# Altium project WaterDepthAnalysisBoardv2.PrjPcb
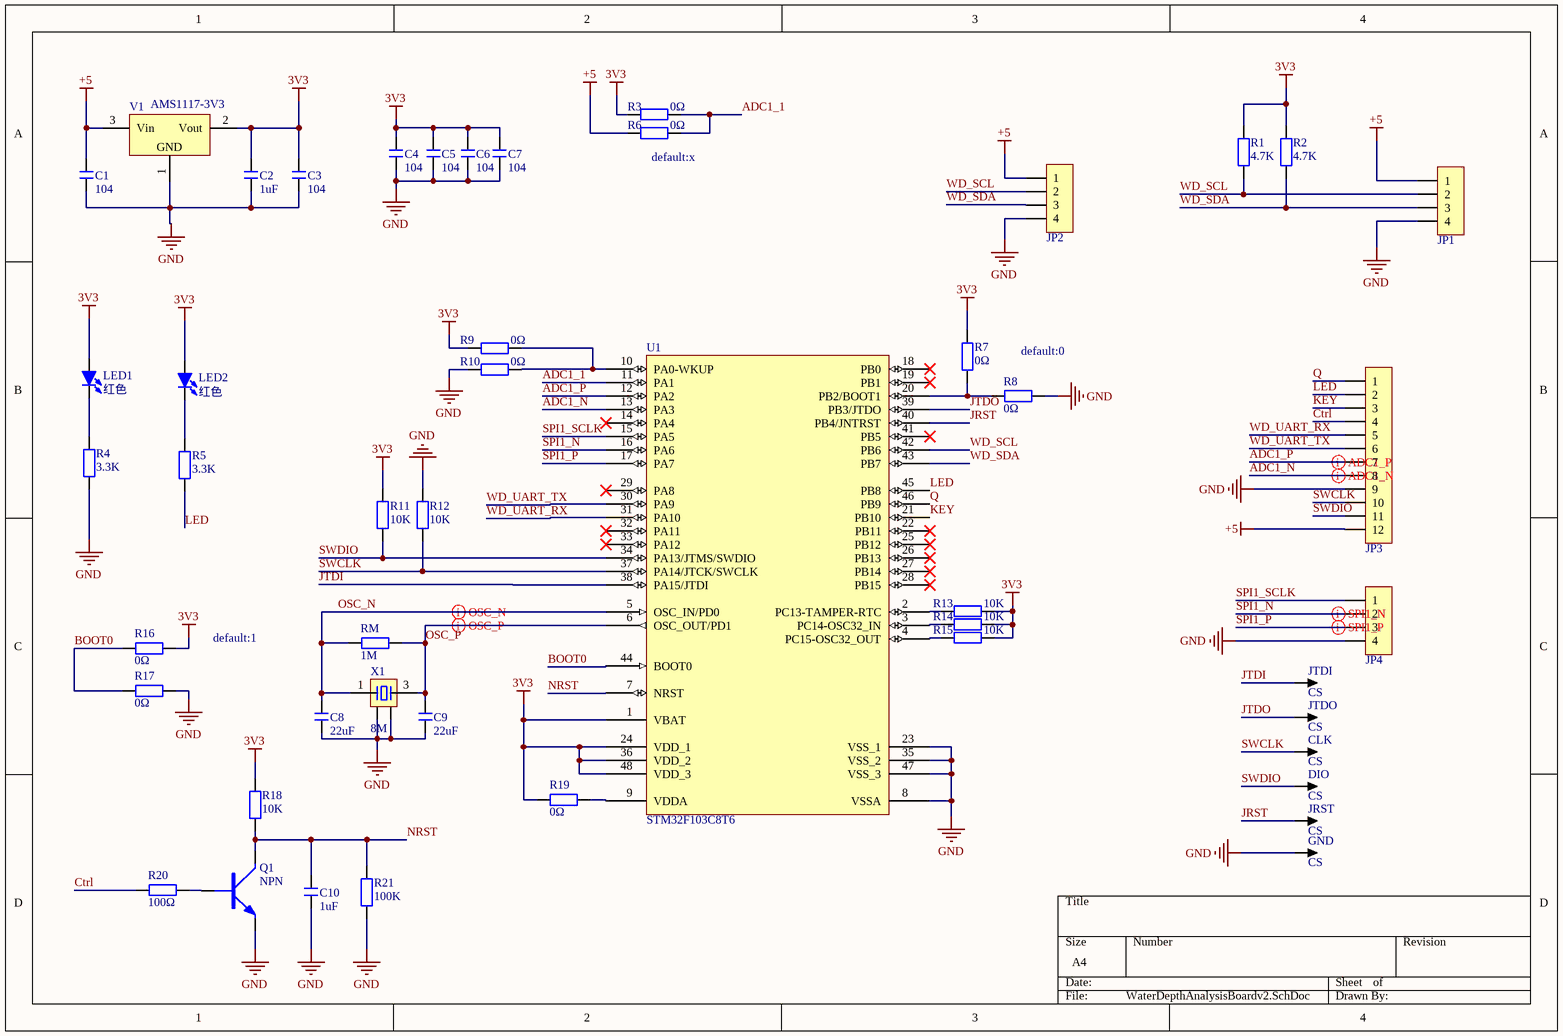
[diagram p0: WaterDepthAnalysisBoardv2.SchDoc]
1 sheet, 48 parts. Net scope: global (net labels, ports and power ports of the same name join across sheets).
Board file: WaterDepthAnalysisBoardv2.PcbDoc

## Sheet WaterDepthAnalysisBoardv2.SchDoc
size A4; SheetNumber: 1; SheetTotal: 1

### Parts
C1  104  [C 0603_L]
C2  1uF  [C 0603_L]
C3  104  [C 0603_L]
C4  104  [C 0603_L]
C5  104  [C 0603_L]
C6  104  [C 0603_L]
C7  104  [C 0603_L]
C8  22uF  [C 0603_L]
C9  22uF  [C 0603_L]
C10  1uF  [C 0603_L]
CLK  CS  [R100]
DIO  CS  [R100]
GND  CS  [R100]
JP1  HDR-1X4  [MX 1.25-LI-4P]  (value not drawn)
JP2  HDR-1X4  [MX 1.25-LS-4P]  (value not drawn)
JP3  HDR-1X12  [HDR2.54-LI-12P]  (value not drawn)
JP4  HDR-1X4  [HDR2.54-LI-4P]  (value not drawn)
JRST  CS  [R100]
JTDI  CS  [R100]
JTDO  CS  [R100]
LED1  红色  [LED 0603W]
LED2  红色  [LED 0603W]
Q1  NPN  [SOT-23]
R1  4.7K  [R 0603_L]
R2  4.7K  [R 0603_L]
R3  0Ω  [R 0603_L]
R4  3.3K  [R 0603_L]
R5  3.3K  [R 0603_L]
R6  0Ω  [R 0603_L]
R7  0Ω  [R 0603_L]
R8  0Ω  [R 0603_L]
R9  0Ω  [R 0603_L]
R10  0Ω  [R 0603_L]
R11  10K  [R 0603_L]
R12  10K  [R 0603_L]
R13  10K  [R 0603_L]
R14  10K  [R 0603_L]
R15  10K  [R 0603_L]
R16  0Ω  [R 0603_L]
R17  0Ω  [R 0603_L]
R18  10K  [R 0603_L]
R19  0Ω  [R 0603_L]
R20  100Ω  [R 0603_L]
R21  100K  [R 0603_L]
RM  1M  [R 0603_L]
U1  STM32F103C8T6  [LQFP48 7X7]
V1  AMS1117-3V3  [SOT89_N]
X1  8M  [OSC 5032-4P]

### Nets
3V3: C2.2 C3.2 C4.2 C5.2 C6.2 C7.2 LED1.1(A) LED2.1(A) R1.2 R2.2 R3.2 R7.1 R9.2 R11.1 R13.1 R14.1 R15.1 R16.1 R18.1 R19.2 U1.1(VBAT) U1.24(VDD_1) U1.36(VDD_2) U1.48(VDD_3) V1.2(Vout)
+5: C1.2 JP1.1 JP2.1 JP3.12 R6.2 V1.3(Vin)
GND: C1.1 C2.1 C3.1 C4.1 C5.1 C6.1 C7.1 C8.1 C9.1 C10.1 GND.1 JP1.4 JP2.4 JP3.9 JP4.4 Q1.E R4.1 R8.1 R10.2 R12.1 R17.1 R21.2 U1.8(VSSA) U1.23(VSS_1) U1.35(VSS_2) U1.47(VSS_3) V1.1(GND) X1.2 X1.4
ADC1_1: R3.1 R6.1 U1.11(PA1)
ADC1_N: JP3.8 U1.13(PA3)
ADC1_P: JP3.7 U1.12(PA2)
BOOT0: R16.2 R17.2 U1.44(BOOT0)
Ctrl: JP3.4 R20.2
JRST: JRST.1 U1.40(PB4/JNTRST)
JTDI: JTDI.1 U1.38(PA15/JTDI)
JTDO: JTDO.1 U1.39(PB3/JTDO)
KEY: JP3.3 U1.21(PB10)
LED: JP3.2 R5.1 U1.45(PB8)
NRST: C10.2 Q1.C R18.2 R21.1 U1.7(NRST)
OSC_N: C8.2 RM.2 U1.5(OSC_IN/PD0) X1.1
OSC_P: C9.2 RM.1 U1.6(OSC_OUT/PD1) X1.3
Q: JP3.1 U1.46(PB9)
SPI1_N: JP4.2 U1.16(PA6)
SPI1_P: JP4.3 U1.17(PA7)
SPI1_SCLK: JP4.1 U1.15(PA5)
SWCLK: CLK.1 JP3.10 R12.2 U1.37(PA14/JTCK/SWCLK)
SWDIO: DIO.1 JP3.11 R11.2 U1.34(PA13/JTMS/SWDIO)
WD_SCL: JP1.2 JP2.2 R1.1 U1.42(PB6)
WD_SDA: JP1.3 JP2.3 R2.1 U1.43(PB7)
WD_UART_RX: JP3.5 U1.31(PA10)
WD_UART_TX: JP3.6 U1.30(PA9)
NetLED1_2: LED1.2(K) R4.2
NetLED2_2: LED2.2(K) R5.2
NetQ1_B: Q1.B R20.1
NetR7_2: R7.2 R8.2 U1.20(PB2/BOOT1)
NetR9_1: R9.1 R10.1 U1.10(PA0-WKUP)
NetR13_2: R13.2 U1.2(PC13-TAMPER-RTC)
NetR14_2: R14.2 U1.3(PC14-OSC32_IN)
NetR15_2: R15.2 U1.4(PC15-OSC32_OUT)
NetR19_1: R19.1 U1.9(VDDA)

Not connected (* = marked no-connect by the designer): U1 14(PA4)* 18(PB0)* 19(PB1)* 22(PB11)* 25(PB12)* 26(PB13)* 27(PB14)* 28(PB15)* 29(PA8)* 32(PA11)* 33(PA12)* 41(PB5)*

### Layout directives
differential pair: ADC1_N, ADC1_P, OSC_N, OSC_P, SPI1_N, SPI1_P

### Notes on the sheet
- (near R6) default:x
- default:0
- default:1

### Library data of the parts
C1-C10 = C: 无极性贴片电容; 版权归属: 源创客; BOM名称: 无极性贴片电容; 学习资源: www.ooocke.com
CLK DIO GND JRST JTDI JTDO = CS: 探针焊盘; 版权归属: 源创客; BOM名称: 探针焊盘; 学习资源: www.ooocke.com
JP1 JP2 JP4 = Header 4: 4P接插件; 版权归属: 源创客; BOM名称: 4P接插件; 学习资源: www.ooocke.com
JP3 = Header 12: 12P接插件; 版权归属: 源创客; BOM名称: 12P接插件; 学习资源: www.ooocke.com
LED1 LED2 = LED-SMD: 贴片LED; 版权归属: 源创客; BOM名称: 贴片LED; 学习资源: www.ooocke.com
Q1 = NPN: NPN三极管
R1-R21 RM = R: 贴片电阻; 版权归属: 源创客; BOM名称: 贴片电阻; 学习资源: www.ooocke.com
V1 = AMS1117: 三端稳压芯片; BOM名称: 稳压芯片; 版权归属: 源创客; 学习资源: www.ooocke.com
X1 = XTAL-4P: 4脚无源晶振; 版权归属: 源创客; BOM名称: 4脚无源晶振; 学习资源: www.ooocke.com